# EAGLE design p1s (EAGLE 9.6.2)
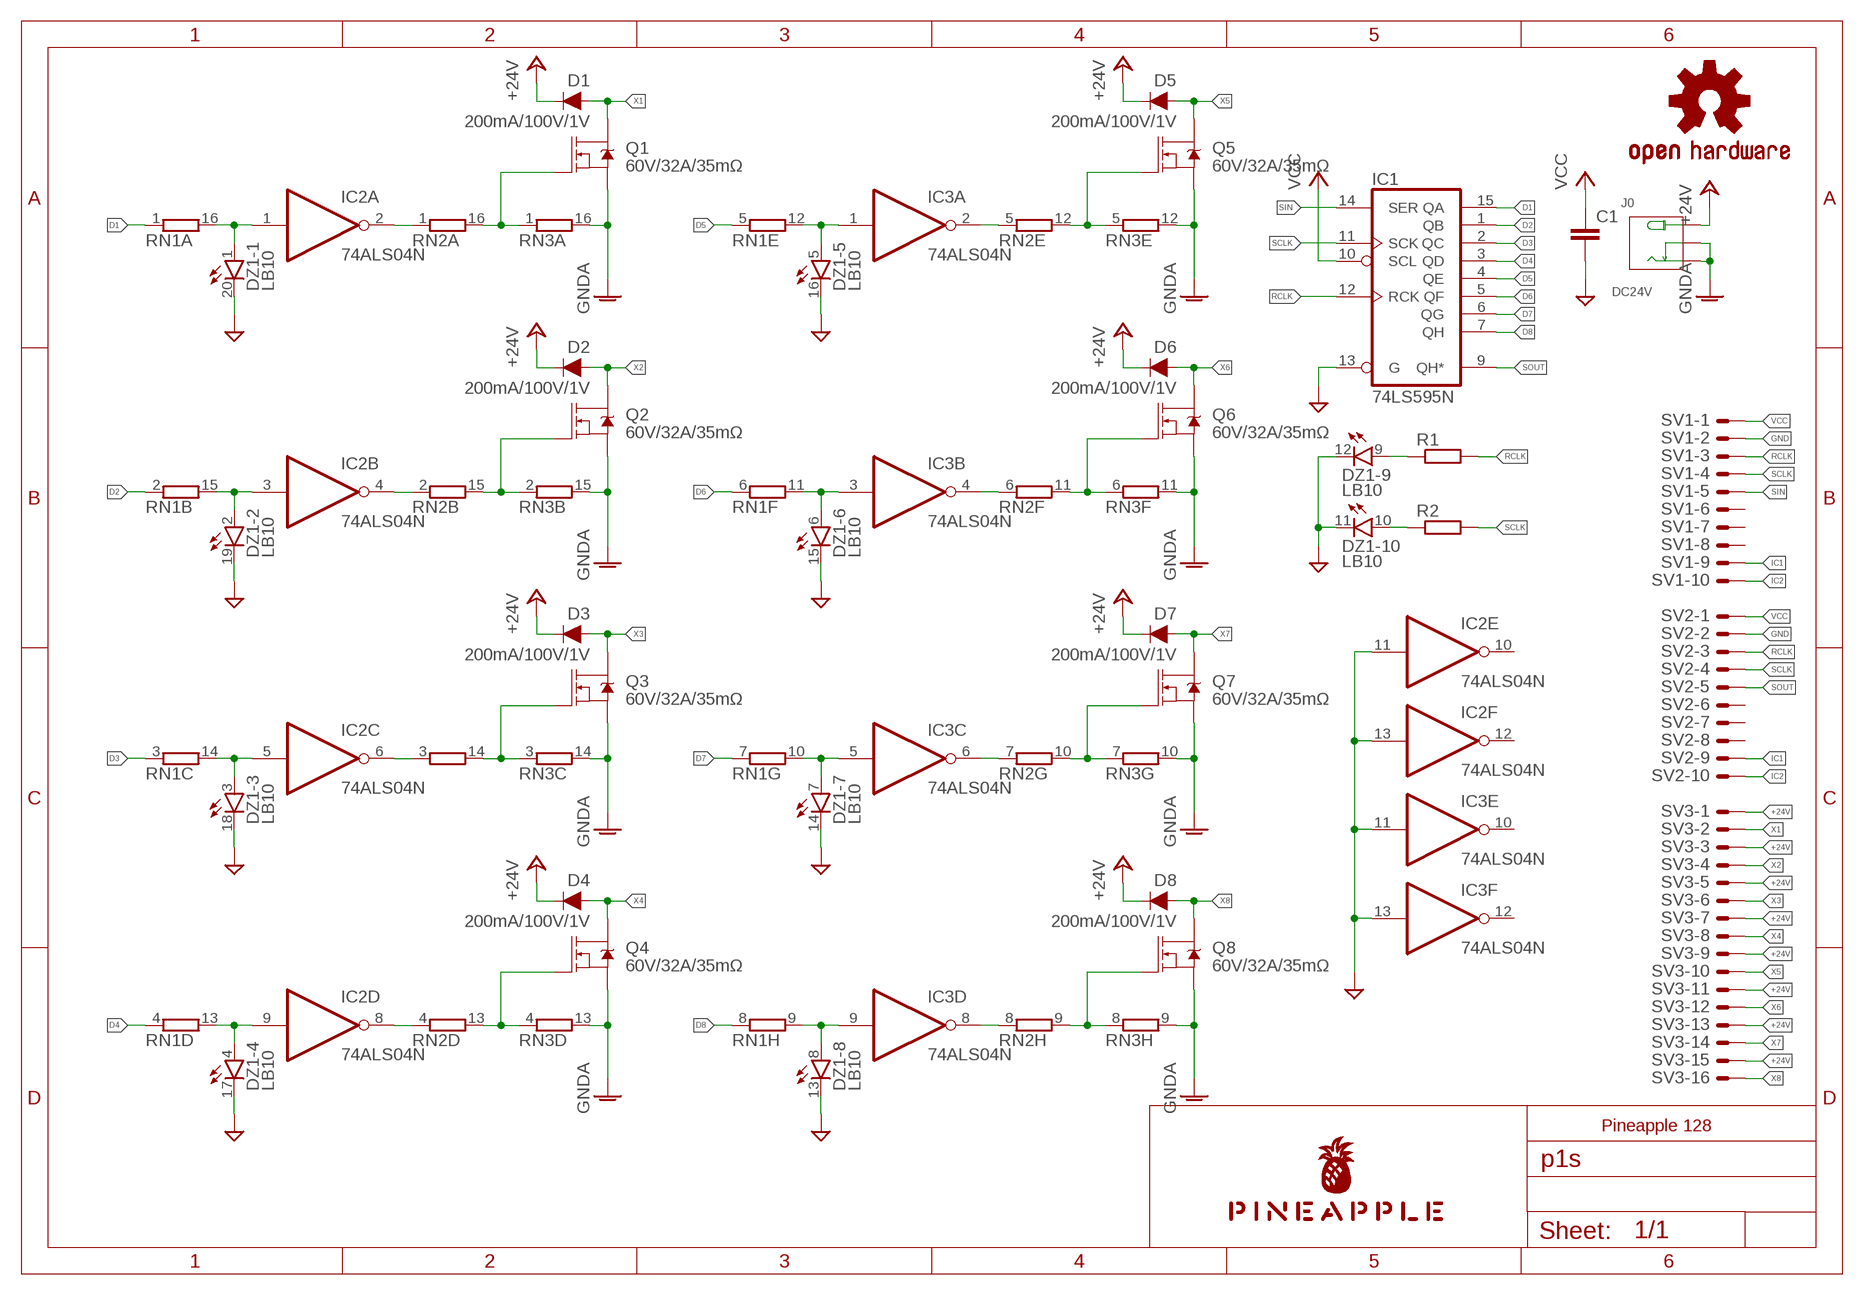
[diagram p0: schematic, sheet 1]

## Parts
C1  C-EU025-024X044  [C025-024X044]
D1  200mA/100V/1V  DIODE-1N4148  [DIODE-1N4148]
D2  200mA/100V/1V  DIODE-1N4148  [DIODE-1N4148]
D3  200mA/100V/1V  DIODE-1N4148  [DIODE-1N4148]
D4  200mA/100V/1V  DIODE-1N4148  [DIODE-1N4148]
D5  200mA/100V/1V  DIODE-1N4148  [DIODE-1N4148]
D6  200mA/100V/1V  DIODE-1N4148  [DIODE-1N4148]
D7  200mA/100V/1V  DIODE-1N4148  [DIODE-1N4148]
D8  200mA/100V/1V  DIODE-1N4148  [DIODE-1N4148]
DZ1  LB10  [LB10]
IC1  74LS595N  [DIL16]
IC2  74ALS04N  [DIL14]
IC3  74ALS04N  [DIL14]
J0  DC24V  JACK-DC-005'DC-005'  [3P-L14.2*W11.0*H9.0MM]
LOGO1  OSHW-LOGOS-COPPER  [OSHW-LOGO-S_COPPER]
Q1  60V/32A/35mΩ  MOSFET-NCH-FQP30N06L  [TO220V]
Q2  60V/32A/35mΩ  MOSFET-NCH-FQP30N06L  [TO220V]
Q3  60V/32A/35mΩ  MOSFET-NCH-FQP30N06L  [TO220V]
Q4  60V/32A/35mΩ  MOSFET-NCH-FQP30N06L  [TO220V]
Q5  60V/32A/35mΩ  MOSFET-NCH-FQP30N06L  [TO220V]
Q6  60V/32A/35mΩ  MOSFET-NCH-FQP30N06L  [TO220V]
Q7  60V/32A/35mΩ  MOSFET-NCH-FQP30N06L  [TO220V]
Q8  60V/32A/35mΩ  MOSFET-NCH-FQP30N06L  [TO220V]
R1  R-EU_0204/5  [0204/5]
R2  R-EU_0204/5  [0204/5]
RN1  8R-N  [DIL16]
RN2  8R-N  [DIL16]
RN3  8R-N  [DIL16]
SV1  ML10LE  [ML10L]
SV2  ML10LE  [ML10L]
SV3  ML16LE  [ML16L]
U$1  PINEAPPLE450_SILK  [PINEAPPLE450_SILK]

## Nets
+24V [power]: D1.C D2.C D3.C D4.C D5.C D6.C D7.C D8.C J0.+ SV3.1 SV3.3 SV3.5 SV3.7 SV3.9 SV3.11 SV3.13 SV3.15
D1: IC1.15(QA) RN1.1
D2: IC1.1(QB) RN1.2
D3: IC1.2(QC) RN1.3
D4: IC1.3(QD) RN1.4
D5: IC1.4(QE) RN1.5
D6: IC1.5(QF) RN1.6
D7: IC1.6(QG) RN1.7
D8: IC1.7(QH) RN1.8
GND [gnd]: C1.2 DZ1.11(-10:C) DZ1.12(-9:C) DZ1.13(-8:C) DZ1.14(-7:C) DZ1.15(-6:C) DZ1.16(-5:C) DZ1.17(-4:C) DZ1.18(-3:C) DZ1.19(-2:C) DZ1.20(-1:C) IC1.13(G) IC2.11(E:I) IC2.13(F:I) IC3.11(E:I) IC3.13(F:I) SV1.2 SV2.2
GNDA [gnd]: J0.-1(-) J0.-2(CDN) Q1.3(S) Q2.3(S) Q3.3(S) Q4.3(S) Q5.3(S) Q6.3(S) Q7.3(S) Q8.3(S) RN3.9 RN3.10 RN3.11 RN3.12 RN3.13 RN3.14 RN3.15 RN3.16
IC1: SV1.9 SV2.9
IC2: SV1.10 SV2.10
N$1: DZ1.1(-1:A) IC2.1(A:I) RN1.16
N$2: IC2.2(A:O) RN2.1
N$3: Q1.1(G) RN2.16 RN3.1
N$4: DZ1.2(-2:A) IC2.3(B:I) RN1.15
N$5: IC2.4(B:O) RN2.2
N$6: Q2.1(G) RN2.15 RN3.2
N$7: DZ1.3(-3:A) IC2.5(C:I) RN1.14
N$8: IC2.6(C:O) RN2.3
N$9: Q3.1(G) RN2.14 RN3.3
N$10: DZ1.4(-4:A) IC2.9(D:I) RN1.13
N$11: IC2.8(D:O) RN2.4
N$12: Q4.1(G) RN2.13 RN3.4
N$13: DZ1.5(-5:A) IC3.1(A:I) RN1.12
N$14: IC3.8(D:O) RN2.8
N$15: Q5.1(G) RN2.12 RN3.5
N$16: DZ1.6(-6:A) IC3.3(B:I) RN1.11
N$17: IC3.6(C:O) RN2.7
N$18: Q6.1(G) RN2.11 RN3.6
N$19: DZ1.7(-7:A) IC3.5(C:I) RN1.10
N$20: IC3.4(B:O) RN2.6
N$21: Q7.1(G) RN2.10 RN3.7
N$22: DZ1.8(-8:A) IC3.9(D:I) RN1.9
N$23: IC3.2(A:O) RN2.5
N$24: Q8.1(G) RN2.9 RN3.8
N$25: DZ1.9(-9:A) R1.1
N$26: DZ1.10(-10:A) R2.1
RCLK: IC1.12(RCK) R1.2 SV1.3 SV2.3
SCLK: IC1.11(SCK) R2.2 SV1.4 SV2.4
SIN: IC1.14(SER) SV1.5
SOUT: IC1.9(QH*) SV2.5
VCC [power]: C1.1 IC1.10(SCL) SV1.1 SV2.1
X1: D1.A Q1.2(D) SV3.2
X2: D2.A Q2.2(D) SV3.4
X3: D3.A Q3.2(D) SV3.6
X4: D4.A Q4.2(D) SV3.8
X5: D5.A Q5.2(D) SV3.10
X6: D6.A Q6.2(D) SV3.12
X7: D7.A Q7.2(D) SV3.14
X8: D8.A Q8.2(D) SV3.16
Unconnected: IC2.10(E:O) IC2.12(F:O) IC3.10(E:O) IC3.12(F:O) SV1.6 SV1.7 SV1.8 SV2.6 SV2.7 SV2.8

## Notes on the sheet
- Pineapple 128

## Power pins joined to a net without a drawn wire
GND: IC1.8(GND) IC2.7(P:GND) IC3.7(P:GND)
VCC: IC1.16(VCC) IC2.14(P:VCC) IC3.14(P:VCC)

## Library data of the parts
C1 = resistor:C-EU: CAPACITOR, European symbol
D1-D8 = SparkFun-DiscreteSemi:DIODE: Diode These are standard reverse protection diodes and small signal diodes. SparkFun Products: SparkFun SparkPunk Sound Kit <https://www.sparkfun.com/products/11177> SparkFun ESP8266 Thing <https://www.sparkfun.com/products/13231>; PROD_ID: DIO-08378
DZ1 = led:LB10: LED BLOCK 10-LED bar graph, DIL, Siemens
IC1 = 74xx-us:74*595: 8-bit SHIFT REGISTER, output latch
IC2 IC3 = 74xx-us:74*04: Hex INVERTER
J0 = Seeed-Connector:JACK-DC-005: 320120003
LOGO1 = SparkFun-Aesthetics:OSHW-LOGO: Open-Source Hardware (OSHW) Logo This logo indicates the piece of hardware it is found on incorporates a OSHW license and/or adheres to the definition of open source hardware found here: http://freedomdefined.org/OSHW
Q1-Q8 = SparkFun-DiscreteSemi:MOSFET-NCH: N-channel MOSFETs Voltage controlled devices that allow control of high current outputs. SparkFun Products: SparkFun OpenScale <https://www.sparkfun.com/products/13261> SparkFun Digital Sandbox <https://www.sparkfun.com/products/12651> SparkFun Monster Moto Shield <https://www.sparkfun.com/products/10182> SparkFun MOSFET Power Controller <https://www.sparkfun.com/products/11214>; PROD_ID: TRANS-10060
R1 R2 = rcl:R-EU_: RESISTOR, European symbol; SPICEPREFIX: R
RN1-RN3 = resistor-dil:8R-N: DIL RESISTOR; OC_FARNELL: unknown; OC_NEWARK: unknown
SV1 SV2 = con-ml:ML10LE: HARTING; OC_FARNELL: unknown; OC_NEWARK: unknown
SV3 = con-ml:ML16LE: HARTING; OC_FARNELL: unknown; OC_NEWARK: unknown
U$1 = pineapple:PINEAPPLE450_SILK

## Net classes
0 default: width 0.152 mm, drill 0.152 mm, clearance 0.152 mm
1 gnd: width 0.61 mm, drill 0.152 mm, clearance 0.152 mm
2 power: width 0.305 mm, drill 0.152 mm, clearance 0.152 mm
3 analog: width 0.152 mm, drill 0.152 mm, clearance 0.152 mm

## Board
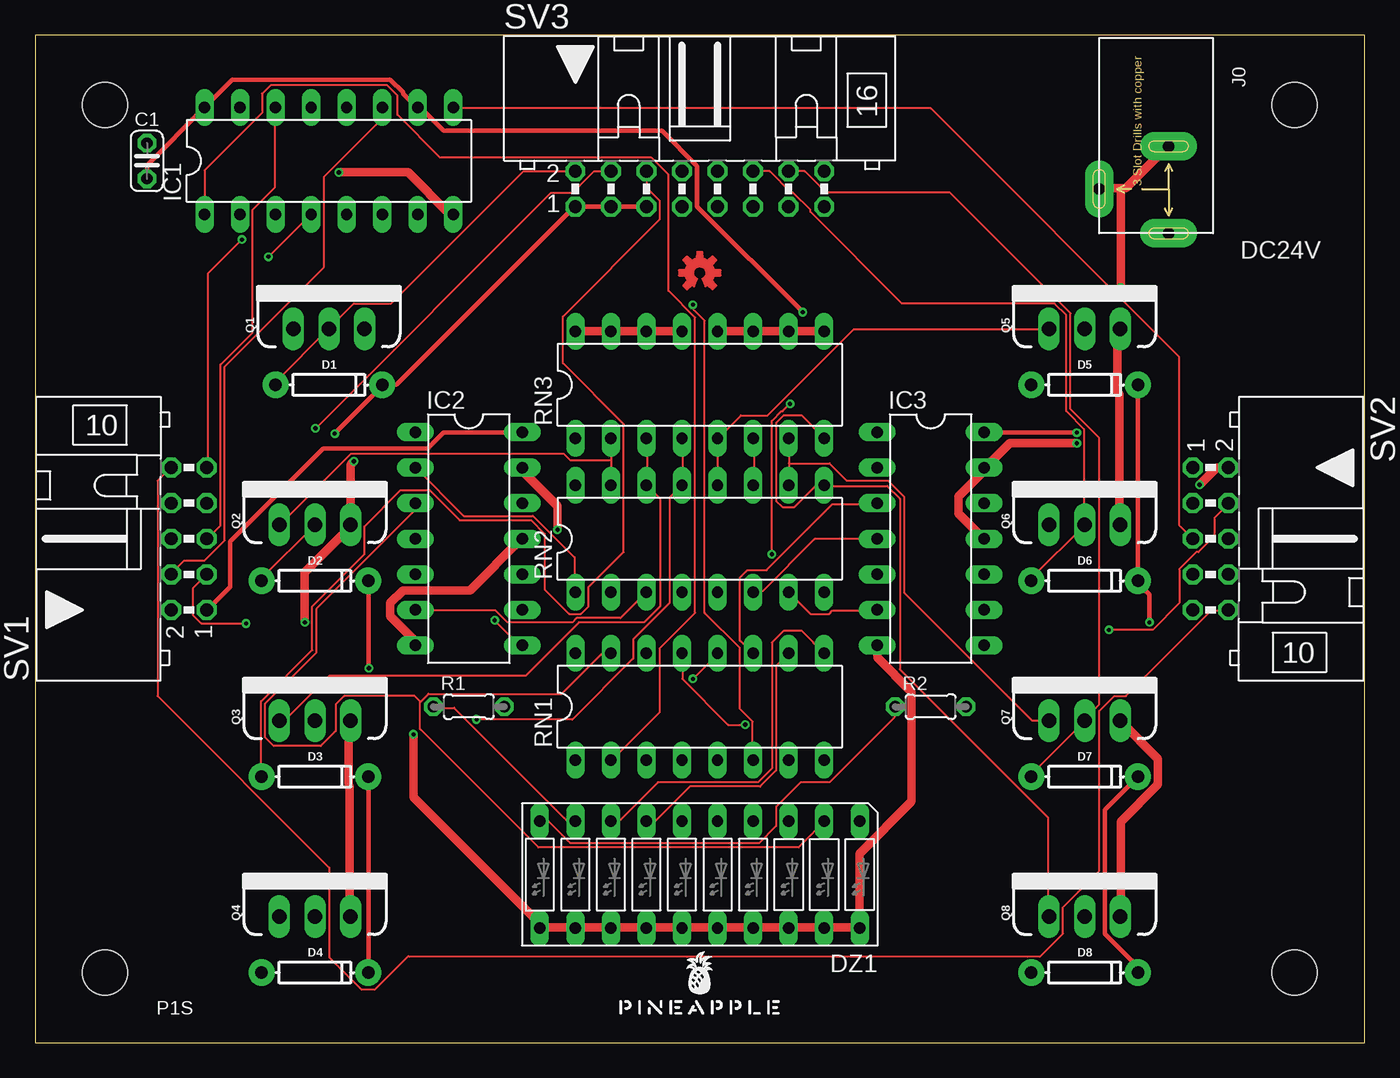
[diagram p1: board, top side]
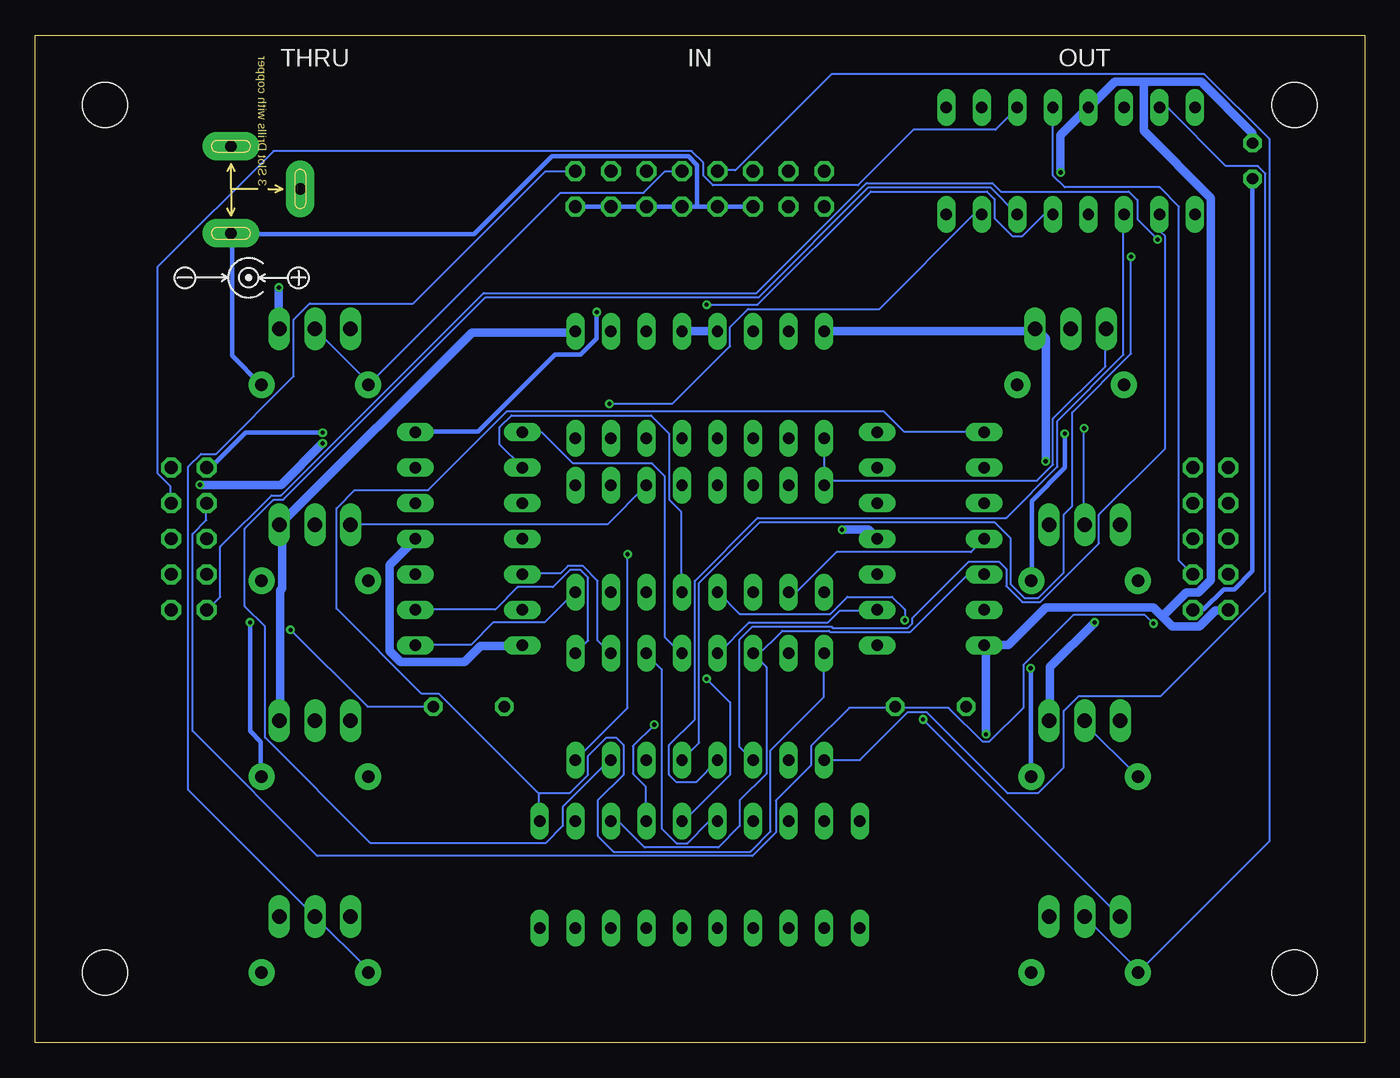
[diagram p2: board, bottom side, seen from below]

Size 95 x 72 mm. Coordinates in mm from the lower left corner, seen from the top.
Outline: 0,0 95,0 95,72 0,72 0,0
Copper layers (1*16): Top 0.035mm / dielectric 1.5mm / Bottom 0.035mm
Design rules "SeeedStudio_2layer_DRU_no_angle_20140221": minimum track width 6mil, minimum drill 12mil, track to track 6mil, track to pad 6mil, pad to pad 6mil, via to via 6mil, smd to smd 0mil, copper to edge 10mil, drill to drill 10mil, minimum pad ring 10mil, minimum via ring 6mil, stop-mask expansion 2mil, vias tented up to drill 100mil, thermal gap 10mil
Holes 3.2 mm at 5,5 90,5 90,67 5,67
tRestrict: area 2.8,64.8 to 7.2,69.2; area 87.8,64.8 to 92.2,69.2; area 2.8,2.8 to 7.2,7.2; area 87.8,2.8 to 92.2,7.2; area 0,71 to 95,72; area 94,0 to 95,72; area 0,0 to 95,1; area 0,0 to 1,72
bRestrict: area 2.8,2.8 to 7.2,7.2; area 87.8,2.8 to 92.2,7.2; area 87.8,64.8 to 92.2,69.2; area 2.8,64.8 to 7.2,69.2; area 0,71 to 95,72; area 94,0 to 95,72; area 0,0 to 95,1; area 0,0 to 1,72

### Footprints (pad centres in the part's own frame; a part is rotated, then mirrored left to right if it is on the bottom)
C025-024X044 = drill 0.813 octagon: 1 -1.27,0; 2 1.27,0
DIODE-1N4148 = drill 0.9 pad 1.88: A -3.81,0; C 3.81,0
LB10 = drill 0.813 long: 1 -11.43,-3.81; 2 -8.89,-3.81; 3 -6.35,-3.81; 4 -3.81,-3.81; 5 -1.27,-3.81; 6 1.27,-3.81; 7 3.81,-3.81; 8 6.35,-3.81; 9 8.89,-3.81; 10 11.43,-3.81; 11 11.43,3.81; 12 8.89,3.81; 13 6.35,3.81; 14 3.81,3.81; 15 1.27,3.81; 16 -1.27,3.81; 17 -3.81,3.81; 18 -6.35,3.81; 19 -8.89,3.81; 20 -11.43,3.81
DIL16 = drill 0.813 long: 1 -8.89,-3.81; 2 -6.35,-3.81; 3 -3.81,-3.81; 4 -1.27,-3.81; 5 1.27,-3.81; 6 3.81,-3.81; 7 6.35,-3.81; 8 8.89,-3.81; 9 8.89,3.81; 10 6.35,3.81; 11 3.81,3.81; 12 1.27,3.81; 13 -1.27,3.81; 14 -3.81,3.81; 15 -6.35,3.81; 16 -8.89,3.81
DIL14 = drill 0.813 long: 1 -7.62,-3.81; 2 -5.08,-3.81; 3 -2.54,-3.81; 4 0,-3.81; 5 2.54,-3.81; 6 5.08,-3.81; 7 7.62,-3.81; 8 7.62,3.81; 9 5.08,3.81; 10 2.54,3.81; 11 0,3.81; 12 -2.54,3.81; 13 -5.08,3.81; 14 -7.62,3.81
3P-L14.2*W11.0*H9.0MM = drill 0.813 pad 2.032 long: + 3.175,0; -1 -3.048,0; -2 0,-4.953
TO220V = drill 1.016 long: 1 -2.54,0; 2 0,0; 3 2.54,0
0204/5 = drill 0.813 octagon: 1 -2.54,0; 2 2.54,0
ML10L = drill 0.914 octagon: 1 -5.08,-1.27; 2 -5.08,1.27; 3 -2.54,-1.27; 4 -2.54,1.27; 5 0,-1.27; 6 0,1.27; 7 2.54,-1.27; 8 2.54,1.27; 9 5.08,-1.27; 10 5.08,1.27
ML16L = drill 0.914 octagon: 1 -8.89,-1.27; 2 -8.89,1.27; 3 -6.35,-1.27; 4 -6.35,1.27; 5 -3.81,-1.27; 6 -3.81,1.27; 7 -1.27,-1.27; 8 -1.27,1.27; 9 1.27,-1.27; 10 1.27,1.27; 11 3.81,-1.27; 12 3.81,1.27; 13 6.35,-1.27; 14 6.35,1.27; 15 8.89,-1.27; 16 8.89,1.27

### Placement (x,y rotation side)
C1  8,63 90 top
D1  21,47 0 top
D2  20,33 0 top
D3  20,19 0 top
D4  20,5 0 top
D5  75,47 0 top
D6  75,33 0 top
D7  75,19 0 top
D8  75,5 0 top
DZ1  47.5,12 180 top
IC1  21,63 0 top
IC2  31,36 270 top
IC3  64,36 270 top
J0  81,61 270 top
LOGO1  47.5,55 0 top
Q1  21,51 0 top
Q2  20,37 0 top
Q3  20,23 0 top
Q4  20,9 0 top
Q5  75,51 0 top
Q6  75,37 0 top
Q7  75,23 0 top
Q8  75,9 0 top
R1  31,24 0 top
R2  64,24 0 top
RN1  47.5,24 0 top
RN2  47.5,36 0 top
RN3  47.5,47 0 top
SV1  11,36 90 top
SV2  84,36 270 top
SV3  47.5,61 0 top
U$1  47.5,2 0 top

### Tracks (layer width: path | path; a pad name or v marks a point on that pad's centre or on a via)
+24V  (via drill 0.3)
  Top 0.305: D8.C 78.79,5.03 78.79,5.41 76.43,7.77 76.43,16.61 78.79,18.97 D7.C | D5.C 78.79,46.94 78.79,33.07 D6.C 78.79,32.84 79.63,32 v79.63,30.02 | D4.C 23.85,5.03 23.85,18.97 D3.C | v23.85,26.75 23.85,32.99 D2.C | SV3.5 43.66,59.74 41.3,59.74 SV3.3 38.63,59.74 SV3.1 38.48,59.66 25.83,47.02 24.84,47.02 D1.C 24.77,46.86 v21.41,43.51
  Bottom 0.305: D5.C 78.87,47.02 80.92,49.07 80.92,57.76 J0.+ 80.77,57.76 63.63,57.76 58.06,63.32 48.31,63.32 47.7,62.71 47.7,59.74 | v79.63,30.02 79.63,22.25 78.87,21.49 78.87,19.05 D7.C | v23.85,26.75 23.85,19.05 D3.C | SV3.5 43.74,59.74 46.18,59.74 SV3.7 46.33,59.74 47.7,59.74 | 47.7,59.74 SV3.9 48.92,59.74 51.28,59.74 SV3.11 51.44,59.74 53.8,59.74 SV3.13 53.95,59.74 SV3.15 | v21.41,43.51 21.41,41.07 23.77,38.71 23.77,33.07 D2.C
D1
  Bottom 0.152: IC1.15 14.63,66.75 14.02,66.75 9.91,62.64 7.62,62.64 7.09,62.1 7.09,32.23 14.55,24.77 20.42,24.77 21.49,23.7 21.49,19.66 23.32,17.83 25.53,17.83 31.32,23.62 32.61,23.62 36.04,20.19 38.56,20.19 RN1.1
D2
  Top 0.152: IC1.1 12.12,59.21 12.12,62.33 16.23,66.45 16.23,67.82 16.84,68.43 25.15,68.43 25.91,67.67 25.91,66.29 28.96,63.25 44.04,63.25 45.26,62.03 45.26,53.72 47.17,51.82 47.17,30.71 44.65,28.19 44.65,23.62 41.22,20.19 RN1.2
D3
  Bottom 0.152: IC1.2 14.63,59.13 14.63,57.99 14.25,57.61 14.25,42.44 18.97,37.72 18.97,35.66 23.16,31.47 24.46,31.47 25.6,32.61 25.6,33.83 26.14,34.37 28.27,34.37 32.31,30.33 32.31,29.95 32.61,29.64 38.02,29.64 38.1,29.72 43.74,29.72 44.65,28.8 44.65,21.11 43.74,20.19 RN1.3
D4
  Bottom 0.152: IC1.3 17.22,59.13 17.22,49.15 21.95,44.42 21.95,41.15 25.6,37.49 43.36,37.49 47.85,32.99 47.85,23.09 49.68,21.26 49.68,19.13 49.15,18.59 47.78,18.59 46.25,20.12 RN1.4
D5  (via drill 0.3)
  Top 0.152: v16.69,56.16 19.66,59.13 IC1.4
  Bottom 0.152: v16.69,56.16 16.69,49.23 20.88,45.03 20.88,38.33 21.49,37.72 21.49,33.6 23.32,31.77 24.31,31.77 25.3,32.77 25.3,36.04 26.44,37.19 43.2,37.19 47.55,32.84 47.55,21.41 RN1.5
D6  (via drill 0.3)
  Top 0.152: v47.02,52.73 47.02,52.43 47.85,51.59 47.85,30.71 50.37,28.19 50.37,23.85 51.28,22.94 51.28,20.19 RN1.6
  Bottom 0.152: v47.02,52.73 43.36,52.73 35.28,60.81 26.98,60.81 26.44,60.27 26.44,58.9 25.15,57.61 24.46,57.61 22.94,59.13 22.33,59.13 IC1.5
D7
  Bottom 0.152: IC1.6 24.84,59.21 26.75,61.11 35.43,61.11 43.28,53.26 62.79,53.26 77.27,38.79 77.95,38.79 80.01,36.73 80.01,31.17 78.56,29.72 78.56,21.79 71.02,14.25 58.52,14.25 57.3,15.47 57.3,16.84 54.03,20.12 53.87,20.12 RN1.7
D8  (via drill 0.3)
  Top 0.152: v53.95,45.64 53.42,45.11 53.34,45.11 52.65,44.42 v52.65,34.9
  Bottom 0.152: v53.95,45.64 49.45,45.64 45.34,49.76 45.34,51.13 44.04,52.43 34.67,52.43 27.96,59.13 27.36,59.13 IC1.7 | v52.65,34.9 52.65,23.93 RN1.8
GND  (via drill 0.3)
  Top 0.61: v21.72,62.18 26.67,62.18 29.64,59.21 29.87,59.21 IC1.8 | IC2.7 27.13,28.42 27.13,28.73 25.38,30.48 25.38,31.39 26.29,32.31 31.09,32.31 34.75,35.97 IC2.11 | v37.34,36.65 37.34,38.33 34.82,40.84 34.82,41.07 IC2.13 | IC3.11 67.74,36.04 65.99,37.8 65.99,39.01 67.74,40.77 67.74,41.07 IC3.13 68.05,41.22 69.65,42.82 v74.45,42.82 | v83.21,39.85 84.43,41.07 SV2.2 | IC3.7 60.2,28.35 60.2,27.51 62.64,25.07 62.64,17.22 58.9,13.49 58.9,8.53 DZ1.20 58.9,8.23 56.69,8.23 DZ1.19 56.39,8.23 54.1,8.23 DZ1.18 53.8,8.23 51.59,8.23 DZ1.17 51.28,8.23 49.07,8.23 DZ1.16 48.77,8.23 46.48,8.23 DZ1.15 46.18,8.23 43.97,8.23 DZ1.14 43.66,8.23 41.45,8.23 DZ1.13 41.15,8.23 38.86,8.23 DZ1.12 38.56,8.23 36.12,8.23 DZ1.11 36.04,8.53 27.05,17.53 v27.05,22.02
  Bottom 0.61: 15.77,68.66 17.83,68.66 19.66,66.83 IC1.13 19.96,66.6 21.72,64.85 v21.72,62.18 | 15.77,68.66 11.66,68.66 8,65 8,64.31 C1.2 | v37.34,36.65 35.43,36.65 34.82,36.04 IC2.11 | 14.44,30.44 15.09,31.09 22.78,31.09 25.45,28.42 27.13,28.42 IC2.7 27.05,28.12 v27.05,22.02 | 14.44,30.44 13.72,29.72 11.81,29.72 10.67,30.86 9.75,30.86 SV1.2 | 15.77,68.66 15.77,65.15 10.97,60.35 10.97,33.07 11.89,32.16 12.72,32.16 14.44,30.44 | IC3.7 60.2,28.35 63.17,28.35 64.31,27.2 68.89,27.2 69.65,27.96 69.65,34.14 67.82,35.97 IC3.11 | v83.21,39.85 77.42,39.85 v74.45,42.82
GNDA  (via drill 0.3)
  Top 0.61: Q8.3 77.57,9.07 77.57,15.77 80.24,18.44 80.24,20.27 77.57,22.94 Q7.3 | 77.57,61.04 77.95,61.04 80.92,64.01 J0.-1 | 77.57,61.04 76.05,61.04 J0.-2 | Q6.3 77.5,37.03 77.5,46.33 77.34,46.48 77.34,50.83 77.5,50.98 Q5.3 | v77.57,53.95 77.57,61.04 | RN3.16 38.63,50.83 41.15,50.83 RN3.15 41.45,50.83 43.66,50.83 RN3.14 43.97,50.83 46.18,50.83 RN3.13 | RN3.12 48.84,50.83 51.28,50.83 RN3.11 51.59,50.83 53.8,50.83 RN3.10 54.1,50.83 56.39,50.83 RN3.9 | Q4.3 22.48,9.07 22.48,18.29 22.4,18.36 22.4,22.86 22.48,22.94 Q3.3 | v22.78,41.53 22.55,41.3 22.55,37.03 Q2.3 22.4,36.73 19.28,33.6 v19.28,30.02
  Bottom 0.61: v77.57,53.95 77.57,51.05 Q5.3 | Q7.3 77.5,23.01 77.5,32.31 77.34,32.46 77.34,36.8 77.5,36.96 Q6.3 77.34,37.19 63.78,50.75 56.46,50.75 RN3.9 | RN3.13 46.25,50.83 48.77,50.83 RN3.12 | v22.78,41.53 22.78,50.29 23.47,50.98 Q1.3 23.77,50.83 38.56,50.83 RN3.16 | v19.28,30.02 22.48,26.82 22.48,23.01 Q3.3
IC1  (via drill 0.3)
  Top 0.152: v14.78,57.38 12.34,54.94 12.34,41.15 SV1.9
  Bottom 0.152: v14.78,57.38 16.23,58.83 16.23,60.2 16.84,60.81 25.98,60.81 26.59,61.42 35.59,61.42 43.43,53.57 62.94,53.57 77.42,39.09 78.11,39.09 81.76,35.43 81.76,31.85 82.68,30.94 SV2.9
IC2
  Top 0.152: SV2.10 85.27,30.86 84.05,30.86 77.95,24.77 77.11,24.77 76.05,23.7 76.05,12.27 73.46,9.68 73.46,7.77 71.86,6.17 26.67,6.17 24.31,3.81 23.32,3.81 21.03,6.1 21.03,12.5 8.76,24.77 8.76,40.16 9.68,41.07 SV1.10
N$1
  Bottom 0.152: 59.02,17.79 58.98,17.75 58.98,15.85 DZ1.1 | 59.02,17.79 66.14,24.92 67.36,24.92 73.46,31.01 73.46,38.18 72.16,39.47 66.9,39.47 61.27,45.11 34.37,45.11 32.92,43.66 27.2,43.66 IC2.1 | RN1.16 38.63,27.74 38.63,24.69 42.44,20.88 42.44,15.09 43.89,13.64 53.65,13.64 54.79,14.78 54.79,17.3 52.96,19.13 52.96,21.26 53.49,21.79 54.18,21.79 55.47,20.5 55.47,19.13 56.77,17.83 58.98,17.83 59.02,17.79
N$2
  Top 0.152: RN2.1 38.56,32.23 38.56,34.67 35.59,37.64 30.63,37.64 27.2,41.07 IC2.2
N$3
  Bottom 0.152: 38.63,40.16 38.63,43.13 RN3.1 | 38.63,40.16 38.63,39.85 RN2.16 38.63,40.16 | 38.63,40.16 23.39,40.16 22.25,41.3 22.25,44.58 18.52,48.31 18.52,50.98 Q1.1
N$4
  Top 0.152: 27.55,24.35 27.51,24.31 27.51,22.4 35.97,13.95 54.56,13.95 56.39,15.77 DZ1.2 | 27.55,24.35 28.12,24.92 37.64,24.92 40.46,27.74 41.15,27.74 RN1.15 | 27.55,24.35 27.13,24.77 22.1,24.77 21.49,24.16 21.49,22.25 20.42,21.18 17.07,21.18 16.46,21.79 16.46,24.23 20.12,27.89 20.12,31.01 27.13,38.02 27.13,38.48 IC2.3
N$5
  Bottom 0.152: RN2.2 41.15,32.23 40.54,32.23 37.72,35.05 28.12,35.05 27.2,35.97 IC2.4
N$6
  Top 0.152: 41.15,41.6 41.15,43.13 RN3.2 | 41.15,41.6 41.15,39.85 RN2.15 | 41.15,41.6 38.25,41.6 37.8,42.06 22.55,42.06 17.53,37.03 Q2.1
N$7
  Bottom 0.152: DZ1.3 53.8,15.77 53.26,15.77 51.44,13.95 46.18,13.95 44.65,15.47 44.65,17.3 42.75,19.2 42.75,26.82 43.66,27.74 RN1.14 43.43,27.58 41.6,29.41 38.25,29.41 38.18,29.34 32.46,29.34 28.35,33.45 27.2,33.45 IC2.5
N$8
  Top 0.152: IC2.6 27.2,30.86 32.92,30.86 33.76,30.02 38.41,30.02 38.71,30.33 41.83,30.33 43.66,32.16 RN2.3
N$9
  Top 0.152: RN3.3 43.74,43.13 43.74,39.85 RN2.14 43.74,39.78 44.65,38.86 44.65,31.17 43.51,30.02 38.86,30.02 35.05,26.21 21.03,26.21 17.83,23.01 17.53,23.01 Q3.1
N$10  (via drill 0.3)
  Top 0.152: v50.75,22.71 49.53,22.71 46.25,25.98 46.25,27.74 RN1.13
  Bottom 0.152: v50.75,22.71 52.27,21.18 52.27,19.2 51.36,18.29 51.36,15.85 DZ1.4 | IC2.9 34.82,30.86 37.49,30.86 38.33,30.02 43.97,30.02 46.18,27.81 RN1.13
N$11  (via drill 0.3)
  Top 0.152: v32.84,30.18 34.59,28.42 34.75,28.42 IC2.8
  Bottom 0.152: v32.84,30.18 32.84,30.94 33.76,31.85 36.96,31.85 38.18,30.63 44.65,30.63 46.18,32.16 RN2.4
N$12  (via drill 0.3)
  Top 0.152: RN3.4 46.25,43.13 46.25,39.85 RN2.13 46.18,39.78 45.34,38.94 45.34,31.39 42.75,28.8 42.75,27.43 38.41,23.09 v31.55,23.09
  Bottom 0.152: v31.55,23.09 17.53,9.07 Q4.1
N$13  (via drill 0.3)
  Top 0.152: v47.02,25.98 48.77,27.74 RN1.12
  Bottom 0.152: v47.02,25.98 45.34,24.31 45.34,19.13 48.62,15.85 48.77,15.85 DZ1.5 | IC3.1 60.12,43.59 58.75,43.59 56.54,41.38 50.9,41.38 49.99,40.46 49.99,28.96 48.84,27.81 RN1.12
N$14
  Bottom 0.152: IC3.8 67.74,28.42 63.86,28.42 62.26,30.02 58.6,30.02 56.46,32.16 RN2.8
N$15
  Top 0.152: RN2.12 48.77,39.85 48.77,43.13 RN3.5 48.84,43.2 50.44,44.81 52.35,44.81 58.52,50.98 72.39,50.98 Q5.1
N$16
  Top 0.152: IC3.3 60.12,38.48 57,38.48 52.27,33.76 50.9,33.76 50.37,33.22 50.37,28.73 51.28,27.81 RN1.11
  Bottom 0.152: DZ1.6 46.25,15.77 46.86,15.77 48.39,14.25 49.15,14.25 50.22,15.32 50.22,26.67 51.28,27.74 RN1.11
N$17
  Top 0.152: IC3.6 60.12,30.86 57,30.86 56.77,30.63 55.4,30.63 53.87,32.16 RN2.7
N$18
  Top 0.152: RN2.11 51.36,39.85 51.36,43.13 RN3.6
  Bottom 0.152: Q6.1 72.39,37.03 54.1,37.03 51.36,39.78 RN2.11
N$19
  Top 0.152: DZ1.7 43.74,15.85 44.35,15.85 46.79,18.29 51.82,18.29 52.96,19.43 52.96,26.9 53.8,27.74 RN1.10
  Bottom 0.152: IC3.5 60.12,33.53 57.45,33.53 56.92,34.06 55.85,34.06 54.79,32.99 54.79,28.73 53.87,27.81 RN1.10
N$20
  Top 0.152: RN2.6 51.36,32.23 51.97,32.23 55.7,35.97 60.12,35.97 IC3.4
N$21
  Top 0.152: 53.87,41.38 53.87,43.13 RN3.7 | 53.87,41.38 53.87,39.85 RN2.10 | 53.87,41.38 56.77,41.38 57.99,40.16 60.96,40.16 62.1,39.01 62.1,32.16 71.25,23.01 72.39,23.01 Q7.1
N$22
  Top 0.152: DZ1.8 41.22,15.85 41.76,15.85 44.5,18.59 51.66,18.59 52.65,19.58 52.65,28.57 53.49,29.41 54.79,29.41 RN1.9
  Bottom 0.152: IC3.9 67.74,30.94 62.1,30.94 60.5,32.54 57.99,32.54 56.77,33.76 56.01,33.76 55.47,33.22 55.47,28.73 RN1.9
N$23
  Bottom 0.152: RN2.5 48.84,32.23 48.84,37.95 49.68,38.79 49.68,43.51 50.98,44.81 60.96,44.81 61.8,43.97 61.8,42.75 60.2,41.15 IC3.2
N$24
  Top 0.152: RN3.8 56.39,43.2 54.79,44.81 53.49,44.81 52.96,44.27 52.96,38.71 53.42,38.25 54.25,38.25 55.78,39.78 56.39,39.78 RN2.9 56.46,39.78 60.88,39.78 61.8,38.86 61.8,26.67 72.39,16.08 72.39,9.07 Q8.1
N$25
  Top 0.152: DZ1.9 38.56,15.85 38.02,15.85 29.95,23.93 28.5,23.93 R1.1
N$26
  Top 0.152: DZ1.10 36.12,15.77 36.73,15.77 38.25,14.25 51.74,14.25 52.96,15.47 52.96,16.84 54.71,18.59 56.77,18.59 61.42,23.24 61.42,23.93 R2.1
RCLK  (via drill 0.3)
  Top 0.152: v15.09,29.95 11.89,29.95 11.28,30.56 11.28,32.46 SV1.3
  Bottom 0.152: v15.09,29.95 15.7,30.56 20.8,30.56 24.38,26.98 24.38,23.93 26.82,21.49 27.28,21.49 29.72,23.93 33.53,23.93 R1.2 33.6,23.93 36.8,23.93 39.55,21.18 39.55,19.81 42.06,17.3 42.06,15.01 43.74,13.34 74.83,13.34 83.74,22.25 83.74,36.35 82.75,37.34 82.75,38.48 SV2.3 | IC1.12 22.25,66.75 22.25,61.95 21.41,61.11 14.63,61.11 13.26,59.74 13.26,34.44 12.34,33.53 SV1.3
SCLK  (via drill 0.3)
  Top 0.152: v76.73,29.49 79.86,29.49 81.76,31.39 81.76,33.83 82.98,35.05 83.13,35.05 84.28,36.2 84.28,37.49 85.27,38.48 SV2.4 | IC1.11 24.77,66.75 24.77,65.99 20.65,61.87 20.65,55.4 13.56,48.31 13.56,35.89 12.12,34.44 10.67,34.44 9.75,33.53 SV1.4
  Bottom 0.152: v76.73,29.49 71.25,24 66.6,24 R2.2 | SV2.4 85.34,38.56 85.34,39.78 86.26,40.69 86.26,55.4 77.95,63.7 48.08,63.7 47.24,62.87 47.24,61.95 46.56,61.27 36.2,61.27 32.23,65.23 26.36,65.23 24.84,66.75 IC1.11
SIN
  Top 0.152: IC1.14 17.14,66.75 17.14,61.11 15.54,59.51 15.54,50.75 13.26,48.46 13.26,36.96 12.34,36.04 SV1.5
SOUT
  Top 0.152: IC1.9 29.95,66.75 64.01,66.75 81.76,49 81.76,36.96 82.68,36.04 SV2.5
VCC  (via drill 0.3)
  Top 0.305: IC2.14 34.75,43.59 29.18,43.59 28.04,42.44 20.57,42.44 13.95,35.81 13.95,32.54 12.34,30.94 SV1.1 | v74.45,43.59 67.82,43.59 IC3.14 | C1.1 8,61.8 8,62.71 12.04,66.75 IC1.16 12.19,66.9 14.1,68.81 25.38,68.81 26.29,67.89 26.29,67.82 27.28,66.83 IC1.10 27.51,66.83 29.18,65.15 44.81,65.15 47.32,62.64 47.32,59.74 v54.86,52.2
  Bottom 0.305: v74.45,43.59 79.93,43.59 82.37,41.15 82.68,41.15 SV2.1 | v54.86,52.2 54.86,50.29 56.01,49.15 57.84,49.15 63.32,43.66 67.74,43.66 IC3.14 | SV1.1 12.27,30.94 11.51,30.94 10.06,32.38 9.3,32.38 8,33.68 C1.1
X1
  Top 0.152: SV3.2 38.56,62.26 34.9,62.26 25.45,52.81 22.78,52.81 21.03,51.05 Q1.2 20.95,50.98 17.22,47.24 17.22,47.02 D1.A
X2  (via drill 0.3)
  Top 0.152: v20.04,43.89 36.88,60.73 38.41,60.73 39.93,62.26 41.15,62.26 SV3.4 | D2.A 16.23,33.07 16.23,33.22 19.96,36.96 Q2.2
  Bottom 0.152: v20.04,43.89 20.04,37.03 Q2.2
X3
  Top 0.152: SV3.6 43.74,62.26 43.74,61.04 44.65,60.12 44.65,58.83 37.72,51.89 37.72,48.54 42.06,44.2 42.06,35.05 39.55,32.54 39.55,31.17 39.01,30.63 38.18,30.63 36.42,32.38 36.42,36.35 35.43,37.34 30.33,37.34 28.19,39.47 26.14,39.47 23.55,36.88 23.55,34.9 19.81,31.17 19.81,28.04 16.15,24.38 16.15,19.05 D3.A
  Bottom 0.152: Q3.2 19.96,22.94 19.96,22.78 16.23,19.05 D3.A
X4
  Bottom 0.152: 16.08,5.11 16.15,5.03 D4.A 16.08,5.11 | 16.08,5.11 6.78,14.4 6.78,64.54 11.43,69.19 38.1,69.19 44.96,62.33 46.18,62.33 SV3.8 | 16.08,5.11 19.96,8.99 Q4.2
X5
  Bottom 0.152: 71.09,47.09 71.17,47.02 D5.A 71.09,47.09 | 71.09,47.09 57.45,60.73 51.51,60.73 49.99,62.26 48.84,62.26 SV3.10 | 71.09,47.09 74.98,50.98 Q5.2
X6
  Top 0.152: SV3.12 51.36,62.26 52.5,62.26 54.03,60.73 54.18,60.73 55.4,59.51 55.4,59.36 61.95,52.81 72.85,52.81 73.69,51.97 73.69,45.11 74.98,43.81 74.98,37.03 Q6.2 74.98,36.96 71.25,33.22 71.25,33.07 D6.A
X7
  Top 0.152: SV3.14 53.87,62.26 55.02,62.26 56.54,60.73 65.38,60.73 73.99,52.12 73.99,45.26 76.05,43.2 76.05,24.16 75.06,23.16 75.06,23.01 Q7.2 74.98,22.94 71.25,19.2 71.25,19.05 D7.A
X8
  Bottom 0.152: SV3.16 56.46,62.26 58.52,62.26 67.97,52.81 75.36,52.81 76.5,51.66 76.5,47.62 82.07,42.06 83.13,42.06 84.05,41.15 84.05,18.06 75.06,9.07 Q8.2 74.98,8.99 71.25,5.26 71.25,5.03 D8.A

### Text on the board
tNames: DC24V | P1S
bNames: OUT | IN | THRU